# EasyEDA schematic 1-Schematic_RFID_WAVER.json
TITLE: Sheet_1; REV: 1.0; Date: 2024-08-12; Sheet: 1/1; Drawn By: maarnotto; Company: Your Company
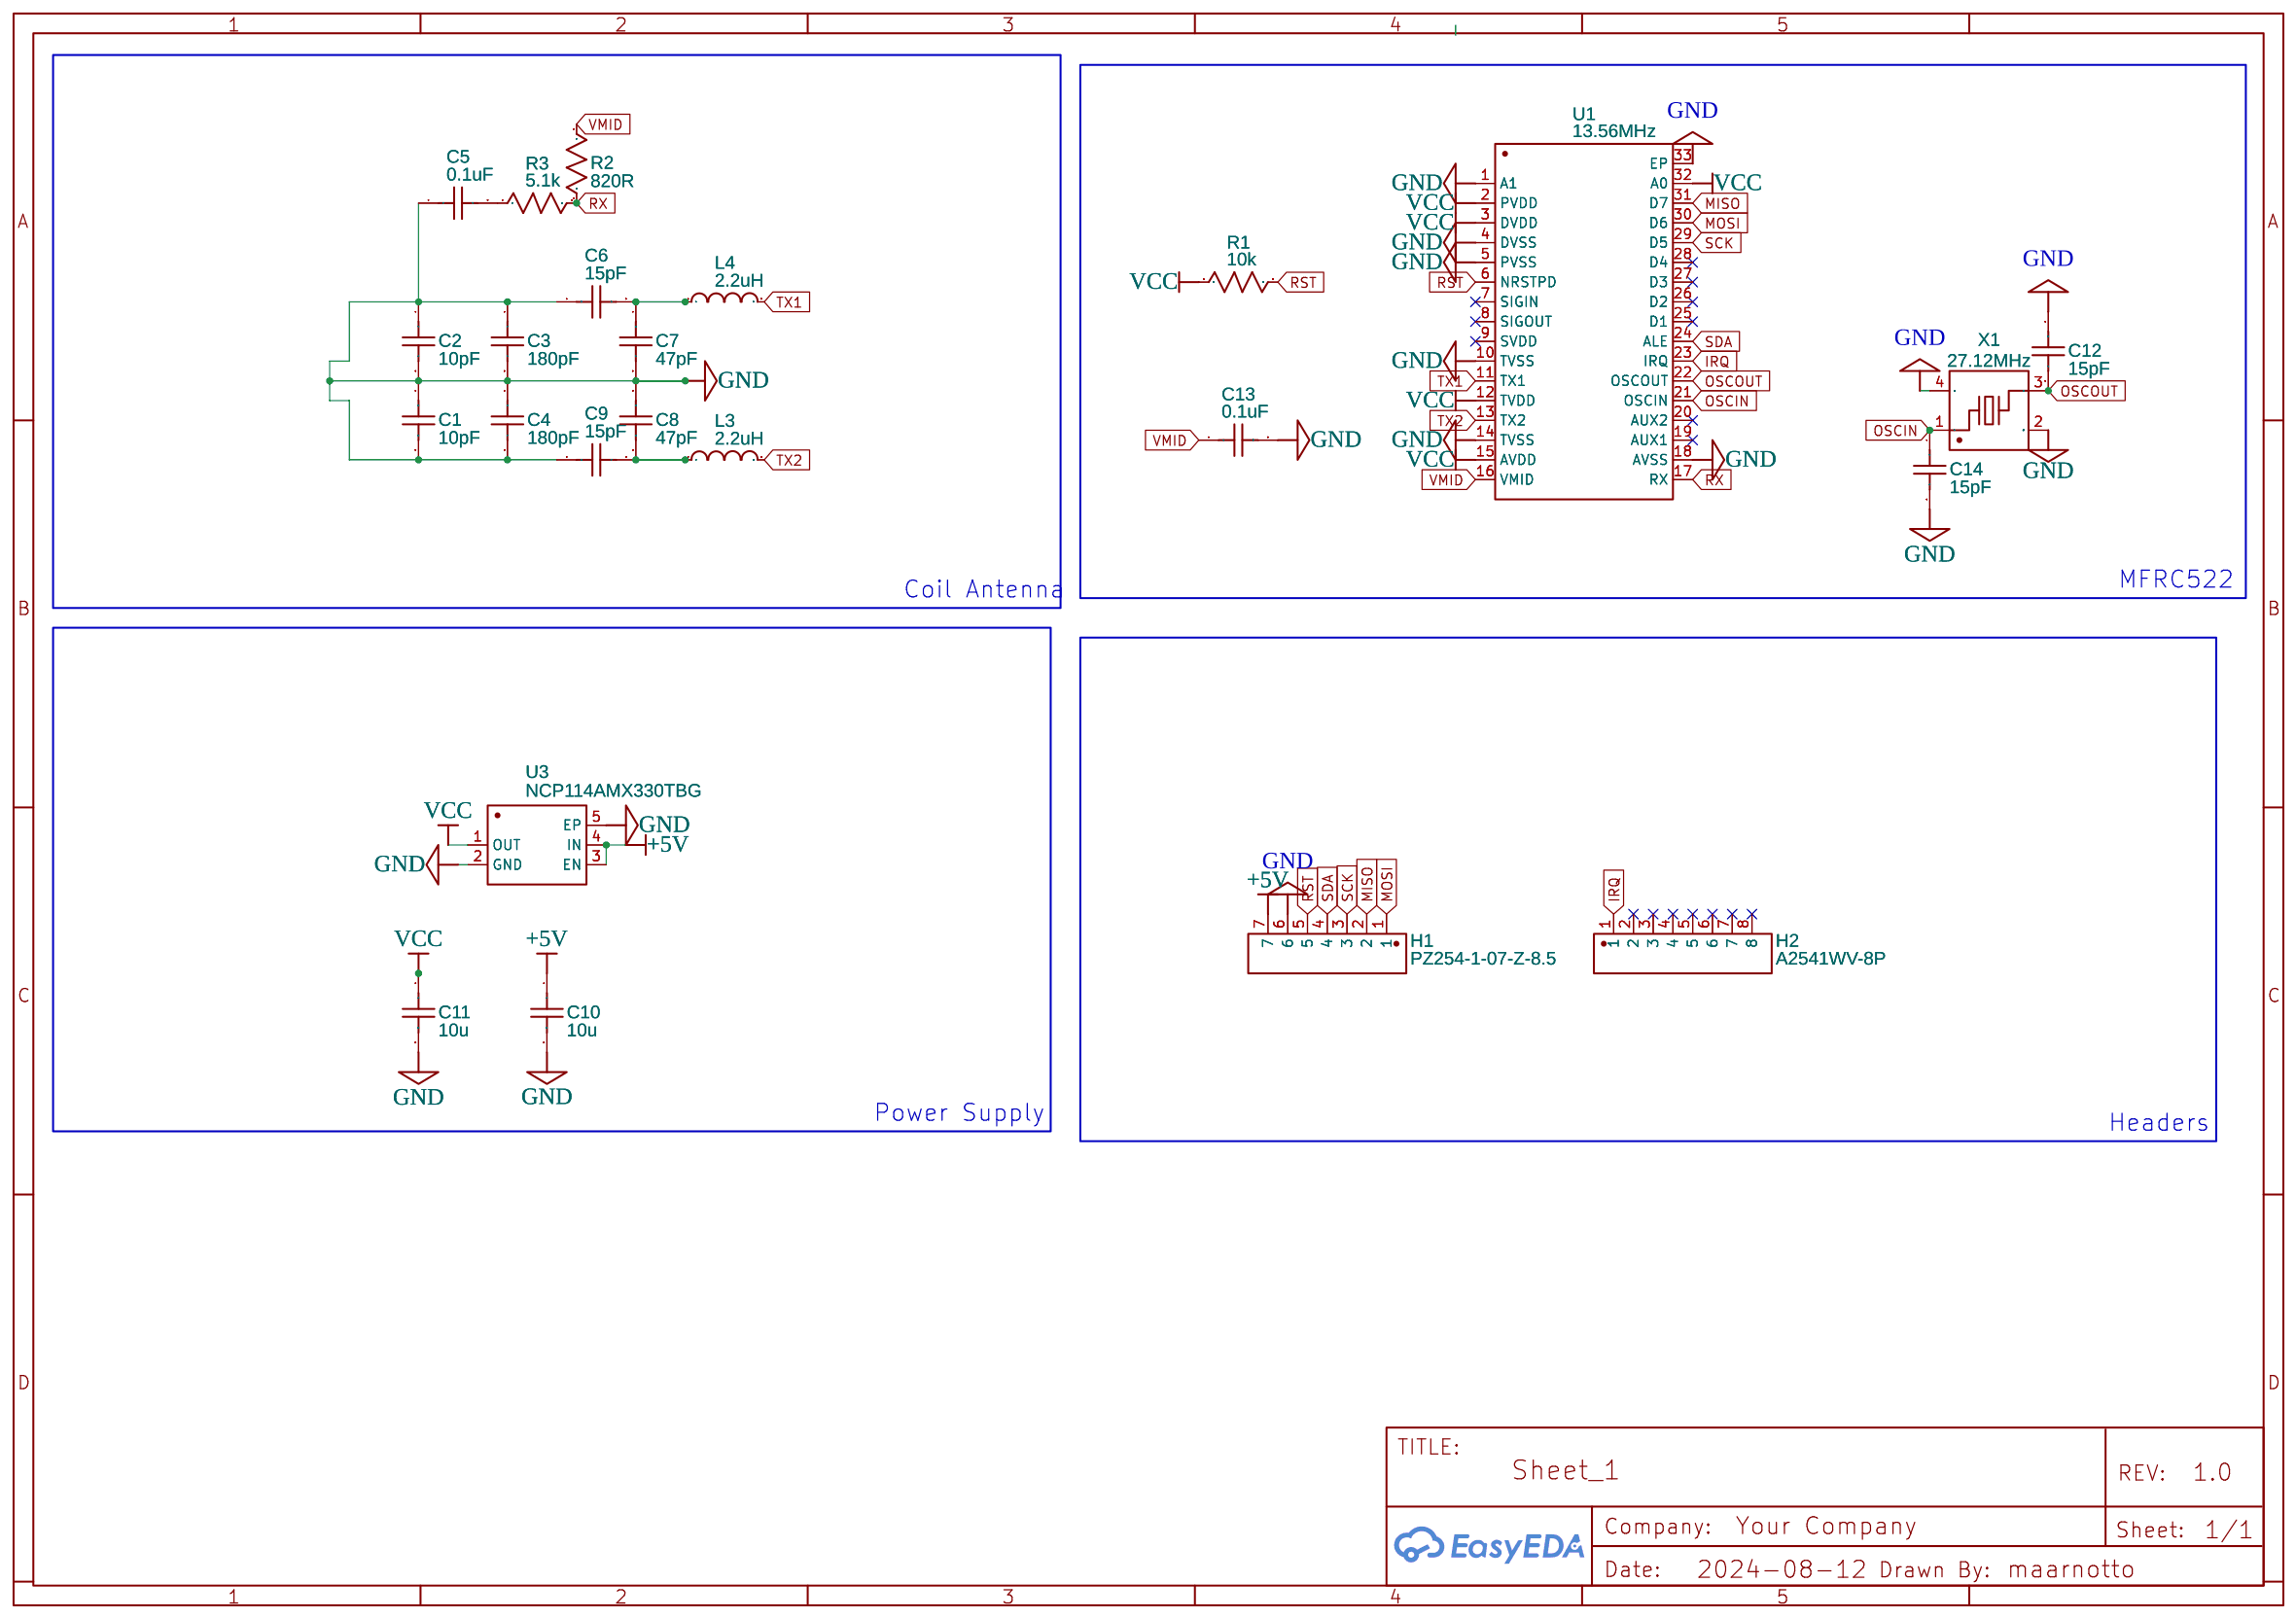
[diagram p0: schematic sheet]

## Parts
C1  10pF  [C0603]
C2  10pF  [C0603]
C3  180pF  [C0603]
C4  180pF  [C0603]
C5  0.1uF  [C0603]
C6  15pF  [C0603]
C7  47pF  [C0603]
C8  47pF  [C0603]
C9  15pF  [C0603]
C10  10u  [C0603]
C11  10u  [C0603]
C12  15pF  [C0603]
C13  0.1uF  [C0603]
C14  15pF  [C0603]
H1  PZ254-1-07-Z-8.5  [HDR-TH_07P-P2.54-V-M]
H2  A2541WV-8P  [HDR-TH_8P-P2.54-V-M]
L3  2.2uH  [L0603]
L4  2.2uH  [L0603]
R1  10k  [R0603]
R2  820R  [R0603]
R3  5.1k  [R0603]
U1  13.56MHz  [QFN-32_L5.0-W5.0-P0.50-TL-EP3.1]
U3  NCP114AMX330TBG  [UDFN-4_L1.0-W1.0-P0.65-BL-EP]
X1  27.12MHz  [CRYSTAL-SMD_4P-L3.2-W2.5-BL_SIT8008BI]

## Library data of the parts
C1-C14 = C_0603_US: Contributor: LCEDA_Lib
H1 = PZ254-1-07-Z-8.5: Contributor: LCSC; Supplier: LCSC; Supplier Part: C2894930; Manufacturer: HCTL(华灿天禄); JLCPCB Part Class: Extended Part
H2 = A2541WV-8P: Contributor: LCSC; Supplier: LCSC; Supplier Part: C225483; Manufacturer: CJT(长江连接器); JLCPCB Part Class: Extended Part
L3 L4 = L0603_US: Contributor: LCEDA_Lib
R1-R3 = R_0603_US: Contributor: LCEDA_Lib
U1 = MFRC522: Contributor: LCSC; Supplier: LCSC; Supplier Part: C2760772; Manufacturer: JSMSEMI(杰盛微); JLCPCB Part Class: Extended Part
U3 = NCP114AMX330TBG: Contributor: LCSC; Supplier: LCSC; Supplier Part: C603494; Manufacturer: onsemi(安森美); JLCPCB Part Class: Extended Part
X1 = XL2EL89CMI-111YLC-27.12M: Supplier: LCSC; Supplier Part: C5444606; Manufacturer: YXC(扬兴晶振); Contributor: lcsc; JLCPCB Part Class: Extended Part

## Nets
+5V: C10.1 H1.7 U3.3(EN) U3.4(IN)
GND: C1.1 C1.2 C2.1 C2.2 C3.1 C3.2 C4.1 C4.2 C5.1 C6.1 C7.2 C8.1 C9.1 C10.2 C11.2 C12.1 C13.2 C14.2 H1.6 U1.1(A1) U1.4(DVSS) U1.5(PVSS) U1.10(TVSS) U1.14(TVSS) U1.18(AVSS) U1.33(EP) U3.2(GND) U3.5(EP) X1.2(GND) X1.4(GND)
VCC: C11.1 R1.1 U1.2(PVDD) U1.3(DVDD) U1.12(TVDD) U1.15(AVDD) U1.32(A0) U3.1(OUT)
IRQ: H2.1 U1.23(IRQ)
MISO: H1.2 U1.31(D7)
MOSI: H1.1 U1.30(D6)
OSCIN: C14.1 U1.21(OSCIN) X1.1
OSCOUT: C12.2 U1.22(OSCOUT) X1.3
RST: H1.5 R1.2 U1.6(NRSTPD)
RX: R2.2 R3.2 U1.17(RX)
SCK: H1.3 U1.29(D5)
SDA: H1.4 U1.24(ALE)
TX1: L4.2 U1.11(TX1)
TX2: L3.2 U1.13(TX2)
VMID: C13.1 R2.1 U1.16(VMID)
Net-(C5-2): C5.2 R3.1
Net-(C6-2): C6.2 C7.1 L4.1
Net-(C8-2): C8.2 C9.2 L3.1

Not connected (* = marked no-connect by the designer): H2 2* 3* 4* 5* 6* 7* 8*; U1 7(SIGIN)* 8(SIGOUT)* 9(SVDD)* 19(AUX1)* 20(AUX2)* 25(D1)* 26(D2)* 27(D3)* 28(D4)*

## Notes on the sheet
- Coil Antenna
- MFRC522
- Power Supply
- Headers
